# Altium schematic sheet MicrophoneArray.SchDoc
size A
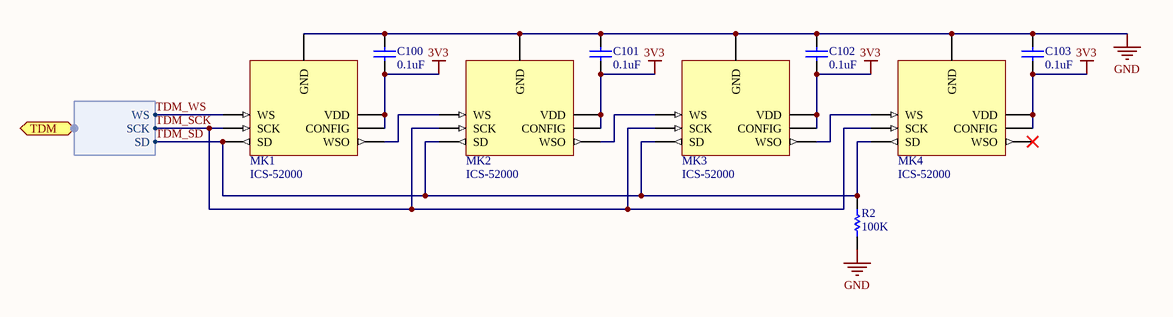
[diagram p0: MicrophoneArray.SchDoc]

## Parts
C100  value 0.1uF  [C0402[1005X55]]  (hidden comment: 0.1uF 6.3V 0402)
C101  value 0.1uF  [C0402[1005X55]]  (hidden comment: 0.1uF 6.3V 0402)
C102  value 0.1uF  [C0402[1005X55]]  (hidden comment: 0.1uF 6.3V 0402)
C103  value 0.1uF  [C0402[1005X55]]  (hidden comment: 0.1uF 6.3V 0402)
MK1  ICS-52000  [MIC]
MK2  ICS-52000  [MIC]
MK3  ICS-52000  [MIC]
MK4  ICS-52000  [MIC]
R2  value 100K  [R0402[1005]]  (hidden comment: 100K 1% 0402)

## Ports
TDM (harness TDM)

## Harnesses
TDM: WS, SCK, SD

## Nets
3V3: C100.1 C101.1 C102.1 C103.1 MK1.2(CONFIG) MK1.3(VDD) MK2.2(CONFIG) MK2.3(VDD) MK3.2(CONFIG) MK3.3(VDD) MK4.2(CONFIG) MK4.3(VDD)
GND: C100.2 C101.2 C102.2 C103.2 MK1.4(GND) MK2.4(GND) MK3.4(GND) MK4.4(GND) R2.1
TDM_SCK: MK1.6(SCK) MK2.6(SCK) MK3.6(SCK) MK4.6(SCK) ; port TDM.SCK
TDM_SD: MK1.7(SD) MK2.7(SD) MK3.7(SD) MK4.7(SD) R2.2 ; port TDM.SD
TDM_WS: MK1.5(WS) ; port TDM.WS
NetMK1_1: MK1.1(WSO) MK2.5(WS)
NetMK2_1: MK2.1(WSO) MK3.5(WS)
NetMK3_1: MK3.1(WSO) MK4.5(WS)

Not connected (* = marked no-connect by the designer): MK4 1(WSO)*

## Library data of the parts
C100-C103 = CAP_0.1uF_6.3V_0402_10%: 0.1uF 6.3V 10% 0402 (1005 Metric); PartNumber: GRM155R70J104KA01D; Manufacturer: Murata; Mounting Technology: Surface Mount; PackageReference: 0402; PackageDescription: 0402 (1005 Metric); Voltage: 6.3V; Tolerance: 10%
MK1-MK4 = ICS-52000: MIC MEMS DIGITAL OMNI -26DB; Manufacturer: TDK InvenSense; PartNumber: ICS-52000; Mounting Technology: Surface Mount
R2 = RES_100K_0402_1%: 100K 0.063W 1% 0402 (1005 Metric); Manufacturer: KOA Speer; PartNumber: RK73H1ETTP1003F; Tolerance: 1%; Power: 0.063W; Mounting Technology: Surface Mount; PackageReference: 0402; PackageDescription: 0402 (1005 Metric); ComponentLink1Description: Datasheet; ComponentLink1URL: http://www.koaspeer.com/catimages/Products/RK73H/RK73H.pdf